# Altium project RFCU_INTERFACE.PrjPCB
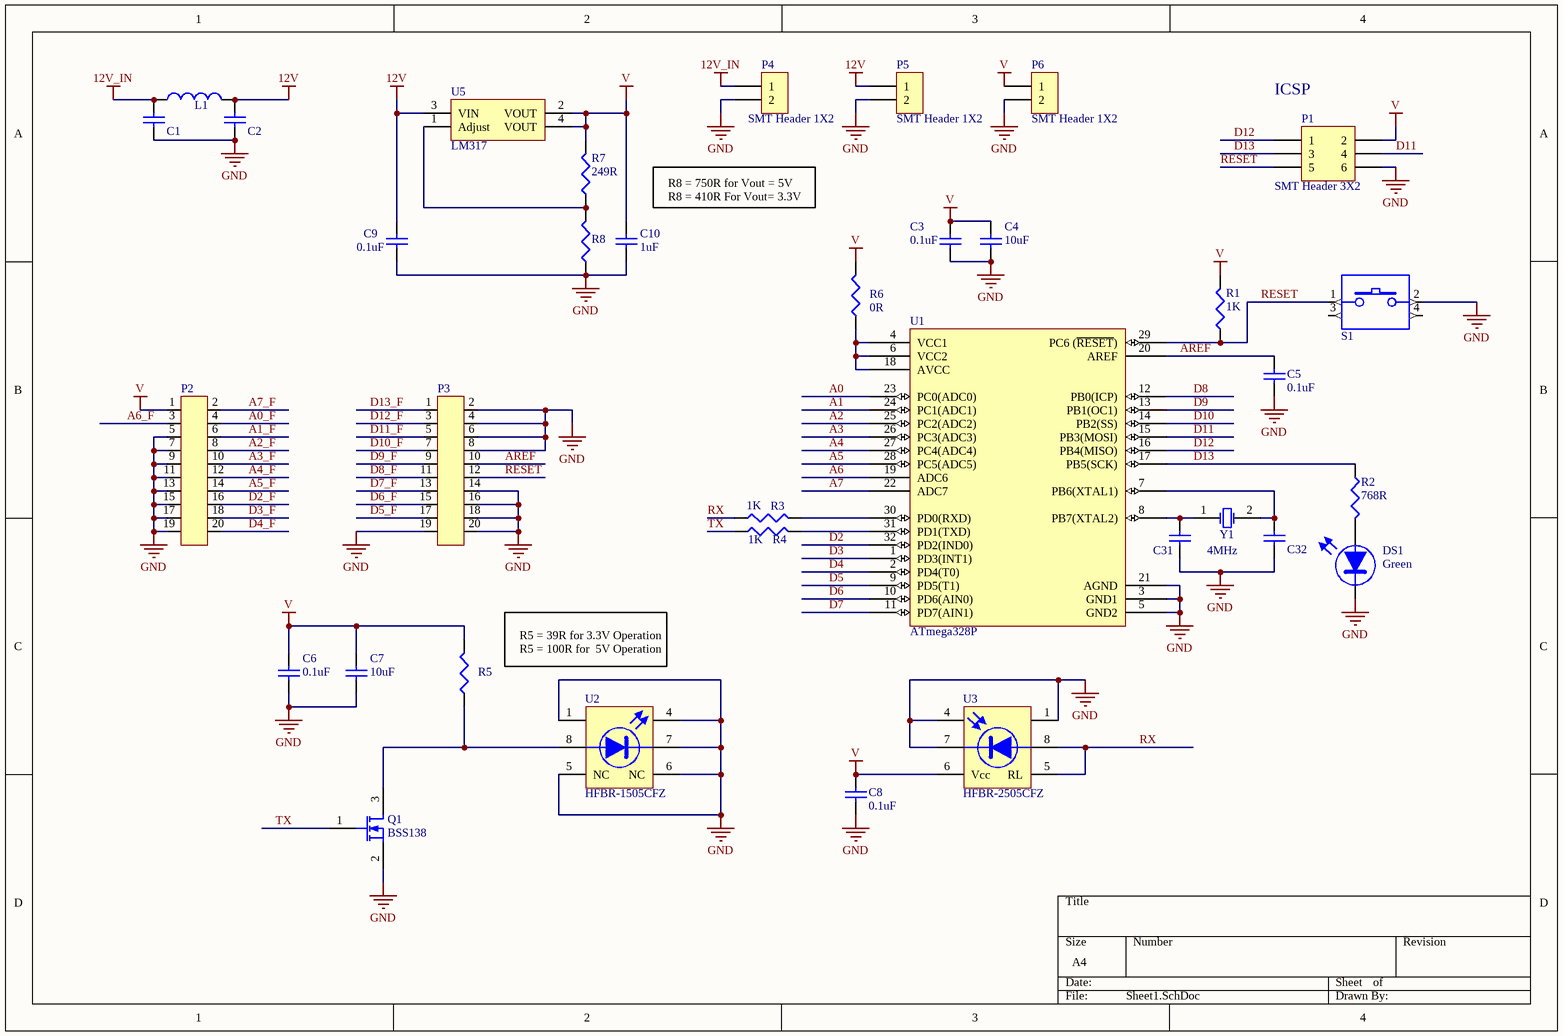
[diagram p0: Sheet1.SchDoc]
2 sheets, 75 parts. Net scope: global (net labels, ports and power ports of the same name join across sheets).
Board file: RFCU_INTERFACE.PcbDoc
Sheets:
  Sheet1.SchDoc
  Sheet2.SchDoc

## Sheet Sheet1.SchDoc
size A4

### Parts
C1  10uF  [CAPC3225X200L]  (value not drawn)
C2  10uF  [CAPC3225X200L]  (value not drawn)
C3  0.1uF  [CAPC1005X60L]
C4  10uF  [CAPC3225X200L]
C5  0.1uF  [CAPC1005X60L]
C6  0.1uF  [CAPC1005X60L]
C7  10uF  [CAPC3225X200L]
C8  0.1uF  [CAPC1005X60L]
C9  0.1uF  [CAPC1005X60L]
C10  1uF  [CAPC2012X127L]
C31  1uF  [CAPC2012X127L]  (value not drawn)
C32  1uF  [CAPC2012X127L]  (value not drawn)
DS1  Colour: Green  [LEDC3216X120N]  (hidden comment: SML-LX1206GC-TR)
L1  180R  [INDC1608X130L]  (value not drawn)
P1  SMT Header 3X2  [HEADER 3x2, SMT]
P2  N2520-6V0C-RB-WE  [3M_N2520-6V0C-RB-WE]  (value not drawn)
P3  N2520-6V0C-RB-WE  [3M_N2520-6V0C-RB-WE]  (value not drawn)
P4  SMT Header 1X2  [HEADER 1x2, SMT]
P5  SMT Header 1X2  [HEADER 1x2, SMT]
P6  SMT Header 1X2  [HEADER 1x2, SMT]
Q1  BSS138  [SOT95P245X110-3N]
R1  1K  [RESC1005X40L]
R2  768R  [RESC1005X40L]
R3  1K  [RESC1005X40L]
R4  1K  [RESC1005X40L]
R5  47R  [RESC1005X40L]  (value not drawn)
R6  0R  [RESC1005X40L]
R7  249R  [RESC1005X40L]
R8  1K  [RESC1005X40L]  (value not drawn)
S1  7914J-1-000-E  [7914J-X-XXX-X]  (value not drawn)
U1  ATmega328P  [TQFP-32A]
U2  HFBR-1505CFZ  [HFBR-X505XFZ]
U3  HFBR-2505CFZ  [HFBR-X505XFZ]
U5  LM317  [SOT223_4N]
Y1  Frequency: 4MHz  [HC-49SM]  (hidden comment: ATS040B)

### Nets
12V: C2.2 C9.2 L1.2 P5.1 U5.3(VIN)
12V_IN: C1.2 L1.1 P4.1
GND: C1.1 C2.1 C3.1 C4.1 C5.1 C6.1 C7.1 C8.2 C9.1 C10.1 C31.1 C32.1 DS1.1(K) P1.6 P2.5 P2.7 P2.9 P2.11 P2.13 P2.15 P2.17 P2.19 P3.2 P3.4 P3.6 P3.8 P3.14 P3.16 P3.18 P3.19 P3.20 P4.2 P5.2 P6.2 Q1.2(S) R8.1 S1.2 U1.3(GND1) U1.5(GND2) U1.21(AGND) U2.1 U2.4 U2.5(NC) U2.6(NC) U2.7(Cathode) U3.1 U3.4 U3.7(Cathode)
V: C3.2 C4.2 C6.2 C7.2 C8.1 C10.2 P1.2 P2.1 P6.1 R1.2 R5.2 R6.2 R7.2 U3.6(Vcc) U5.2(VOUT) U5.4(VOUT)
A0: U1.23(PC0(ADC0))
A0_F: P2.4
A1: U1.24(PC1(ADC1))
A1_F: P2.6
A2: U1.25(PC2(ADC2))
A2_F: P2.8
A3: U1.26(PC3(ADC3))
A3_F: P2.10
A4: U1.27(PC4(ADC4))
A4_F: P2.12
A5: U1.28(PC5(ADC5))
A5_F: P2.14
A6: U1.19(ADC6)
A6_F: P2.3
A7: U1.22(ADC7)
A7_F: P2.2
AREF: C5.2 P3.10 U1.20(AREF)
D2: U1.32(PD2(IND0))
D2_F: P2.16
D3: U1.1(PD3(INT1))
D3_F: P2.18
D4: U1.2(PD4(T0))
D4_F: P2.20
D5: U1.9(PD5(T1))
D5_F: P3.17
D6: U1.10(PD6(AIN0))
D6_F: P3.15
D7: U1.11(PD7(AIN1))
D7_F: P3.13
D8: U1.12(PB0(ICP))
D8_F: P3.11
D9: U1.13(PB1(OC1))
D9_F: P3.9
D10: U1.14(PB2(SS))
D10_F: P3.7
D11: P1.4 U1.15(PB3(MOSI))
D11_F: P3.5
D12: P1.1 U1.16(PB4(MISO))
D12_F: P3.3
D13: P1.3 R2.1 U1.17(PB5(SCK))
D13_F: P3.1
RESET: P1.5 P3.12 R1.1 S1.1 U1.29(PC6_(~{RESET}))
RX: R3.1 U3.5(RL) U3.8(Anode)
TX: Q1.1(G) R4.1
NetC31_2: C31.2 U1.8(PB7(XTAL2)) Y1.1
NetC32_2: C32.2 U1.7(PB6(XTAL1)) Y1.2
NetDS1_2: DS1.2(A) R2.2
NetQ1_3: Q1.3(D) R5.1 U2.8(Anode)
NetR3_2: R3.2 U1.30(PD0(RXD))
NetR4_2: R4.2 U1.31(PD1(TXD))
NetR6_1: R6.1 U1.4(VCC1) U1.6(VCC2) U1.18(AVCC)
NetR7_1: R7.1 R8.2 U5.1(Adjust)

Not connected (* = marked no-connect by the designer): S1 3 4

### Notes on the sheet
- (near P1) ICSP
- R8 = 750R for Vout = 5V
  R8 = 410R For Vout= 3.3V
- R5 = 39R for 3.3V Operation
  R5 = 100R for  5V Operation

### Library data of the parts
C1 C2 C4 C7 = CAP-CER-5: 10uF, Ceramic Capacitor; Manufacturer: MURATA; PartNum: GRM32DR61E106KA12L; Tolerance: 10%; Rating: 25V; Dielectric: X5R; POD number: CAP-CER-5; RoHS: Y; Value: 10uF; Sort Value: 100; Category: Capacitors; Subcategory: Ceramic
C3 C5 C6 C8 C9 = CAP-CER-1: 0.1uF, Ceramic Capacitor; Manufacturer: VENKEL; PartNum: C0402X7R160-104KN; Tolerance: 10%; Rating: 16V; Dielectric: X7R; POD number: CAP-CER-1; RoHS: Y; Value: 0.1uF; Sort Value: 0.1; Category: Capacitors; Subcategory: Ceramic
C10 C31 C32 = CAP-CER-8: 1uF, Ceramic Capacitor; Manufacturer: MURATA; PartNum: GRM21BR61C105KA01L; Tolerance: 10%; Rating: 16V; Dielectric: X5R; POD number: CAP-CER-8; RoHS: Y; Value: 1uF; Sort Value: 100; Category: Capacitors; Subcategory: Ceramic
DS1 = OPTO-LED-0: Green, Surface mount, LED, 1206; Manufacturer: LUMEX; Vdrop: 2.2V; Rating: 20mA; POD number: OPTO-LED-0; PartNum: SML-LX1206GC-TR; RoHS: Y; Category: OPTO; Subcategory: LED
L1 = IND-FB-2: 180 Ohm, Chip Ferrite Brad; Manufacturer: Murata; PartNum: BLM18PG181SN1; DC Res: 0.09R; Tolerance: 25%; Rating: 1500mA; POD number: IND-FB-2; RoHS: Y; Value: 180R; Sort Value: 180; Category: Inductors; Subcategory: FerriteBead
P1 = CONN-PCB-33: 2x3, 2.54 mm Pitch, Male Header, Surface Mount; Manufacturer: AMP; PartNum: 1241050-6; LatestRevisionDate: 17-Jul-2002; LatestRevisionNote: Re-released for DXP Platform.; Publisher: Altium Limited; POD number: CONN-PCB-33; RoHS: Y; Category: CONN; Subcategory: PCB
P2 P3 = CONN-PCB-10: 2x10, 2.54mm Pitch, Male Shrouded Header; Manufacturer: 3M; POD number: CONN-PCB-10; PartNum: N2520-6V0C-RB-WE; RoHS: Y; Category: CONN; Subcategory: PCB
P4-P6 = CONN-PCB-28: 1x2, 2.54 mm Pitch, Male Header, Surface Mount; Manufacturer: AMP; PartNum: 1241050-5; LatestRevisionDate: 17-Jul-2002; LatestRevisionNote: Re-released for DXP Platform.; Publisher: Altium Limited; POD number: CONN-PCB-28; RoHS: Y; Category: CONN; Subcategory: PCB
Q1 = TRANS-NFET-0: N-Channel Logic Level Enhancement Mode Field Effect Transistor; Manufacturer: Fairchild Semiconductor; Rating: 0.22A; POD number: TRANS-NFET-0; PartNum: BSS138; RoHS: Y; Category: TRANS; Subcategory: NFET
R1 R3 R4 R8 = RES-TF-8: 1K, 1.1mm x 0.5mm, Thick Film Resistor; Manufacturer: ROYALOHM; PartNum: 0402WGJ0102T1E; Tolerance: 5%; Rating: 0.0625W; POD number: RES-TF-8; RoHS: Y; Value: 1K; Sort Value: 1000; Category: Resistors; Subcategory: ThickFilm; HelpURL: http://www.royalohm.com/pdf/general.pdf
R2 = RES-TF-48: 768R, 1.1mm x 0.5mm, Thick Film Resistor; Manufacturer: ROYALOHM; PartNum: 0402WGF7680T1E; Tolerance: 1%; Rating: 0.0625W; POD number: RES-TF-48; RoHS: Y; Value: 768R; Sort Value: 768; Category: Resistors; Subcategory: ThickFilm; HelpURL: http://www.royalohm.com/pdf/general.pdf
R5 = RES-TF-12: 47R, 1.1mm x 0.5mm, Thick Film Resistor; Manufacturer: ROYALOHM; PartNum: 0402WGJ0470T1E; Tolerance: 5%; Rating: 0.0625W; POD number: RES-TF-12; RoHS: Y; Value: 47R; Sort Value: 47; Category: Resistors; Subcategory: ThickFilm; HelpURL: http://www.royalohm.com/pdf/general.pdf
R6 = RES-TF-0: 0R, 1.1mm x 0.5mm, Thick Film Resistor; Manufacturer: ROYALOHM; PartNum: 0402WG00000T1E; Tolerance: 0%; Rating: 0.0625W; POD number: RES-TF-0; RoHS: Y; Value: 0R; Sort Value: 0; Category: Resistors; Subcategory: ThickFilm; HelpURL: http://www.royalohm.com/pdf/general.pdf
R7 = RES-TF-15: 249R, 1.1mm x 0.5mm, Thick Film Resistor; Manufacturer: ROYALOHM; PartNum: 0402WGF2490T1E; Tolerance: 1%; Rating: 0.0625W; POD number: RES-TF-15; RoHS: Y; Value: 249R; Sort Value: 249; Category: Resistors; Subcategory: ThickFilm; HelpURL: http://www.royalohm.com/pdf/general.pdf
S1 = ELMECH-SW-1: 4mm, Surface mount, J-Hook, Sealed Key Switch; Manufacturer: BOURNS; POD number: ELMECH-SW-1; PartNum: 7914J-1-000-E; RoHS: Y; Category: ELMECH; Subcategory: Switches
U1 = IC-CPU-2: 8-Bit Microcontroller with 32KB Flash; Manufacturer: Atmel; PartNum: ATmega328P-AU; POD number: IC-CPU-2; RoHS: Y; Category: IC; Subcategory: CPU
U2 = OPTO-TX-0: 650nm Fibre Optic Transmitter; Manufacturer: Avago; Vdrop: NA; POD number: OPTO-TX-0; PartNum: HFBR-1505CFZ; RoHS: Y; Colour: NA; Rating: NA; Category: OPTO; Subcategory: Transmitter; HelpURL: C:\libraries\pcb\Altium\Datasheets\OPTO\AVAGO_HFBR
U3 = OPTO-RX-0: 2MBd Fibre Optic Receiver; Manufacturer: Avago; Vdrop: NA; POD number: OPTO-RX-0; PartNum: HFBR-2505CFZ; RoHS: Y; Colour: NA; Rating: NA; Category: OPTO; Subcategory: Receiver; HelpURL: C:\libraries\pcb\Altium\Datasheets\OPTO\AVAGO_HFBR
U5 = IC-REG-9: Adjustable Voltage regulator 1.25V-37V; Manufacturer: National Semiconductor; PartNum: LM317EMP; POD number: IC-REG-9; RoHS: Y; Category: IC; Subcategory: Regulators
Y1 = RESN-XTAL-6: 4 MHz, Surface mount, Crystal Oscillator; Manufacturer: CTS; Stability: 50 PPM; Load Capacitance: 18 pF; POD number: RESN-XTAL-6; PartNum: ATS040B; RoHS: Y; Category: RESN; Subcategory: Crystal Oscillator

## Sheet Sheet2.SchDoc
size A4
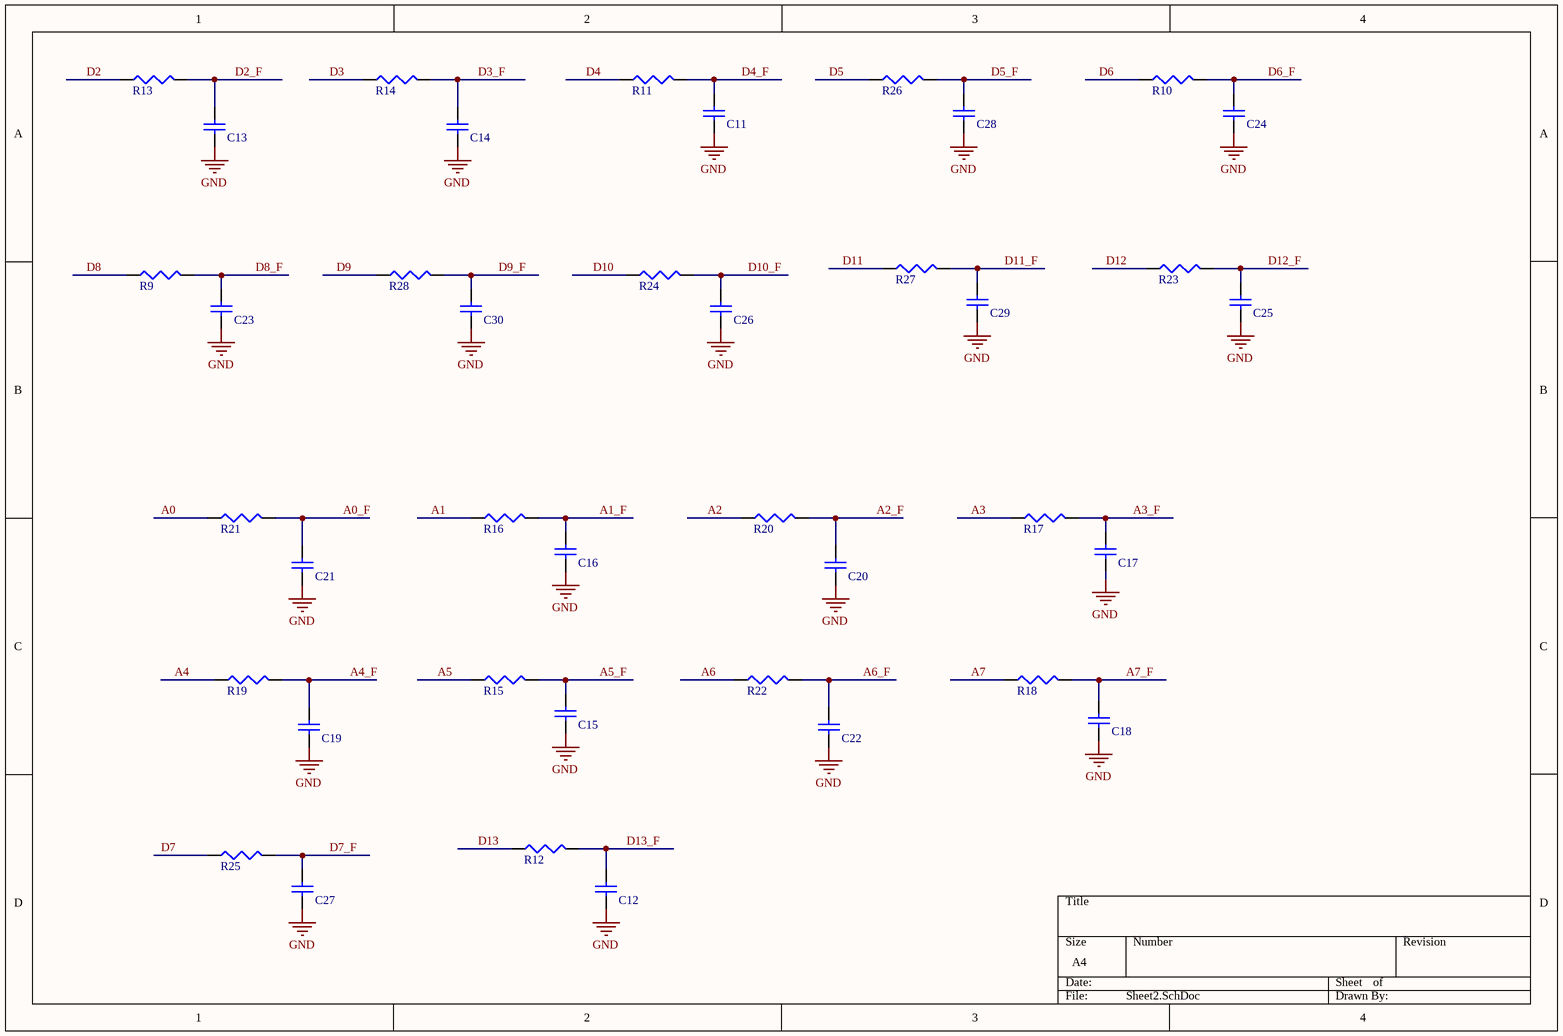
[diagram p1: Sheet2.SchDoc]

### Parts
C11  0.1uF  [CAPC1005X60L]  (value not drawn)
C12  0.1uF  [CAPC1005X60L]  (value not drawn)
C13  0.1uF  [CAPC1005X60L]  (value not drawn)
C14  0.1uF  [CAPC1005X60L]  (value not drawn)
C15  0.1uF  [CAPC1005X60L]  (value not drawn)
C16  0.1uF  [CAPC1005X60L]  (value not drawn)
C17  0.1uF  [CAPC1005X60L]  (value not drawn)
C18  0.1uF  [CAPC1005X60L]  (value not drawn)
C19  0.1uF  [CAPC1005X60L]  (value not drawn)
C20  0.1uF  [CAPC1005X60L]  (value not drawn)
C21  0.1uF  [CAPC1005X60L]  (value not drawn)
C22  0.1uF  [CAPC1005X60L]  (value not drawn)
C23  0.1uF  [CAPC1005X60L]  (value not drawn)
C24  0.1uF  [CAPC1005X60L]  (value not drawn)
C25  0.1uF  [CAPC1005X60L]  (value not drawn)
C26  0.1uF  [CAPC1005X60L]  (value not drawn)
C27  0.1uF  [CAPC1005X60L]  (value not drawn)
C28  0.1uF  [CAPC1005X60L]  (value not drawn)
C29  0.1uF  [CAPC1005X60L]  (value not drawn)
C30  0.1uF  [CAPC1005X60L]  (value not drawn)
R9  75R  [RESC1005X40L]  (value not drawn)
R10  75R  [RESC1005X40L]  (value not drawn)
R11  75R  [RESC1005X40L]  (value not drawn)
R12  75R  [RESC1005X40L]  (value not drawn)
R13  75R  [RESC1005X40L]  (value not drawn)
R14  75R  [RESC1005X40L]  (value not drawn)
R15  75R  [RESC1005X40L]  (value not drawn)
R16  75R  [RESC1005X40L]  (value not drawn)
R17  75R  [RESC1005X40L]  (value not drawn)
R18  75R  [RESC1005X40L]  (value not drawn)
R19  75R  [RESC1005X40L]  (value not drawn)
R20  75R  [RESC1005X40L]  (value not drawn)
R21  75R  [RESC1005X40L]  (value not drawn)
R22  75R  [RESC1005X40L]  (value not drawn)
R23  75R  [RESC1005X40L]  (value not drawn)
R24  75R  [RESC1005X40L]  (value not drawn)
R25  75R  [RESC1005X40L]  (value not drawn)
R26  75R  [RESC1005X40L]  (value not drawn)
R27  75R  [RESC1005X40L]  (value not drawn)
R28  75R  [RESC1005X40L]  (value not drawn)

### Nets
GND: C11.1 C12.1 C13.1 C14.1 C15.1 C16.1 C17.1 C18.1 C19.1 C20.1 C21.1 C22.1 C23.1 C24.1 C25.1 C26.1 C27.1 C28.1 C29.1 C30.1
A0: R21.1
A0_F: C21.2 R21.2
A1: R16.1
A1_F: C16.2 R16.2
A2: R20.1
A2_F: C20.2 R20.2
A3: R17.1
A3_F: C17.2 R17.2
A4: R19.1
A4_F: C19.2 R19.2
A5: R15.1
A5_F: C15.2 R15.2
A6: R22.1
A6_F: C22.2 R22.2
A7: R18.1
A7_F: C18.2 R18.2
D2: R13.1
D2_F: C13.2 R13.2
D3: R14.1
D3_F: C14.2 R14.2
D4: R11.1
D4_F: C11.2 R11.2
D5: R26.1
D5_F: C28.2 R26.2
D6: R10.1
D6_F: C24.2 R10.2
D7: R25.1
D7_F: C27.2 R25.2
D8: R9.1
D8_F: C23.2 R9.2
D9: R28.1
D9_F: C30.2 R28.2
D10: R24.1
D10_F: C26.2 R24.2
D11: R27.1
D11_F: C29.2 R27.2
D12: R23.1
D12_F: C25.2 R23.2
D13: R12.1
D13_F: C12.2 R12.2

### Library data of the parts
C11-C30 = CAP-CER-1: as C3 on sheet Sheet1; POD number: CAP-CER-1; RoHS: Y; Value: 0.1uF; Sort Value: 0.1; Category: Capacitors; Subcategory: Ceramic
R9-R28 = RES-TF-32: 75R, 1.1mm x 0.5mm, Thick Film Resistor; Manufacturer: ROYALOHM; PartNum: 0402WGJ0750T1E; Tolerance: 5%; Rating: 0.0625W; POD number: RES-TF-32; RoHS: Y; Value: 75R; Sort Value: 75; Category: Resistors; Subcategory: ThickFilm; HelpURL: http://www.royalohm.com/pdf/general.pdf

## Nets that join several sheets
GND: Sheet1 (48 pins), Sheet2 (20 pins)
A0: Sheet1 (U1.23), Sheet2 (R21.1)
A0_F: Sheet1 (P2.4), Sheet2 (C21.2 R21.2)
A1: Sheet1 (U1.24), Sheet2 (R16.1)
A1_F: Sheet1 (P2.6), Sheet2 (C16.2 R16.2)
A2: Sheet1 (U1.25), Sheet2 (R20.1)
A2_F: Sheet1 (P2.8), Sheet2 (C20.2 R20.2)
A3: Sheet1 (U1.26), Sheet2 (R17.1)
A3_F: Sheet1 (P2.10), Sheet2 (C17.2 R17.2)
A4: Sheet1 (U1.27), Sheet2 (R19.1)
A4_F: Sheet1 (P2.12), Sheet2 (C19.2 R19.2)
A5: Sheet1 (U1.28), Sheet2 (R15.1)
A5_F: Sheet1 (P2.14), Sheet2 (C15.2 R15.2)
A6: Sheet1 (U1.19), Sheet2 (R22.1)
A6_F: Sheet1 (P2.3), Sheet2 (C22.2 R22.2)
A7: Sheet1 (U1.22), Sheet2 (R18.1)
A7_F: Sheet1 (P2.2), Sheet2 (C18.2 R18.2)
D2: Sheet1 (U1.32), Sheet2 (R13.1)
D2_F: Sheet1 (P2.16), Sheet2 (C13.2 R13.2)
D3: Sheet1 (U1.1), Sheet2 (R14.1)
D3_F: Sheet1 (P2.18), Sheet2 (C14.2 R14.2)
D4: Sheet1 (U1.2), Sheet2 (R11.1)
D4_F: Sheet1 (P2.20), Sheet2 (C11.2 R11.2)
D5: Sheet1 (U1.9), Sheet2 (R26.1)
D5_F: Sheet1 (P3.17), Sheet2 (C28.2 R26.2)
D6: Sheet1 (U1.10), Sheet2 (R10.1)
D6_F: Sheet1 (P3.15), Sheet2 (C24.2 R10.2)
D7: Sheet1 (U1.11), Sheet2 (R25.1)
D7_F: Sheet1 (P3.13), Sheet2 (C27.2 R25.2)
D8: Sheet1 (U1.12), Sheet2 (R9.1)
D8_F: Sheet1 (P3.11), Sheet2 (C23.2 R9.2)
D9: Sheet1 (U1.13), Sheet2 (R28.1)
D9_F: Sheet1 (P3.9), Sheet2 (C30.2 R28.2)
D10: Sheet1 (U1.14), Sheet2 (R24.1)
D10_F: Sheet1 (P3.7), Sheet2 (C26.2 R24.2)
D11: Sheet1 (P1.4 U1.15), Sheet2 (R27.1)
D11_F: Sheet1 (P3.5), Sheet2 (C29.2 R27.2)
D12: Sheet1 (P1.1 U1.16), Sheet2 (R23.1)
D12_F: Sheet1 (P3.3), Sheet2 (C25.2 R23.2)
D13: Sheet1 (P1.3 R2.1 U1.17), Sheet2 (R12.1)
D13_F: Sheet1 (P3.1), Sheet2 (C12.2 R12.2)